# Altium schematic sheet 57. EVM SOC CURRENT_SENSE_RES.SchDoc: SOC - CURRENT SENSE RESISTORS
size 513 x 386 mm; Project: PROC154E2(001)_SK_AM69; Issue: 1.0; RevCode: E3; Page Create Date: March  8, 1995; Variant Name: Core Design; Schematic Page Number: 57; Page Number: 57; Page Size: C; Comment: MISTRAL_TITLEBLK_CSIZE_1; Page Count: 62; Schematic Page Count: 62; Name: PROC154E2 001 SK AM69; DsnPath: C:\Users\danie\Downloads\sprr466c\PROC154E3_RP\PROC154E3_SCH.DSN; SchematicName: SCHEMATIC1; PageName: 57. EVM SOC CURRENT_SENSE_RES; PageSize: C; TopSchematic: True
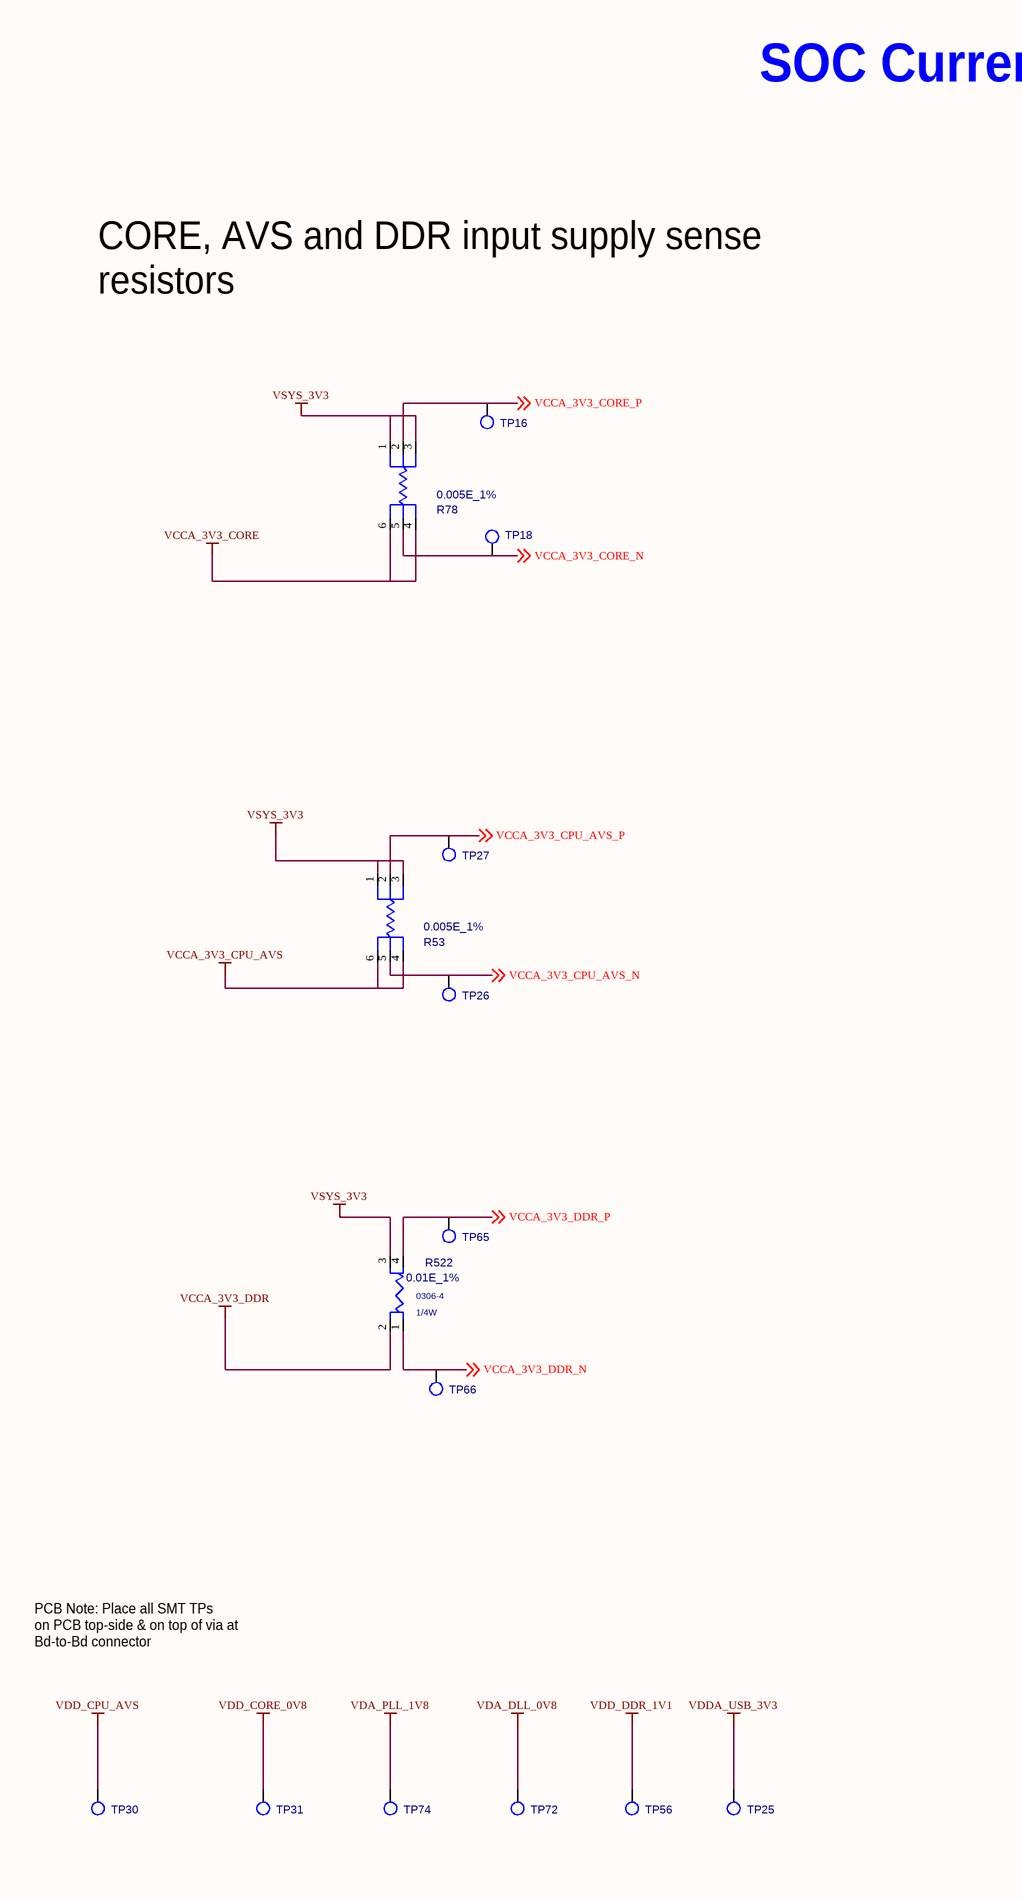
[diagram p0: 57. EVM SOC CURRENT_SENSE_RES.SchDoc, left]
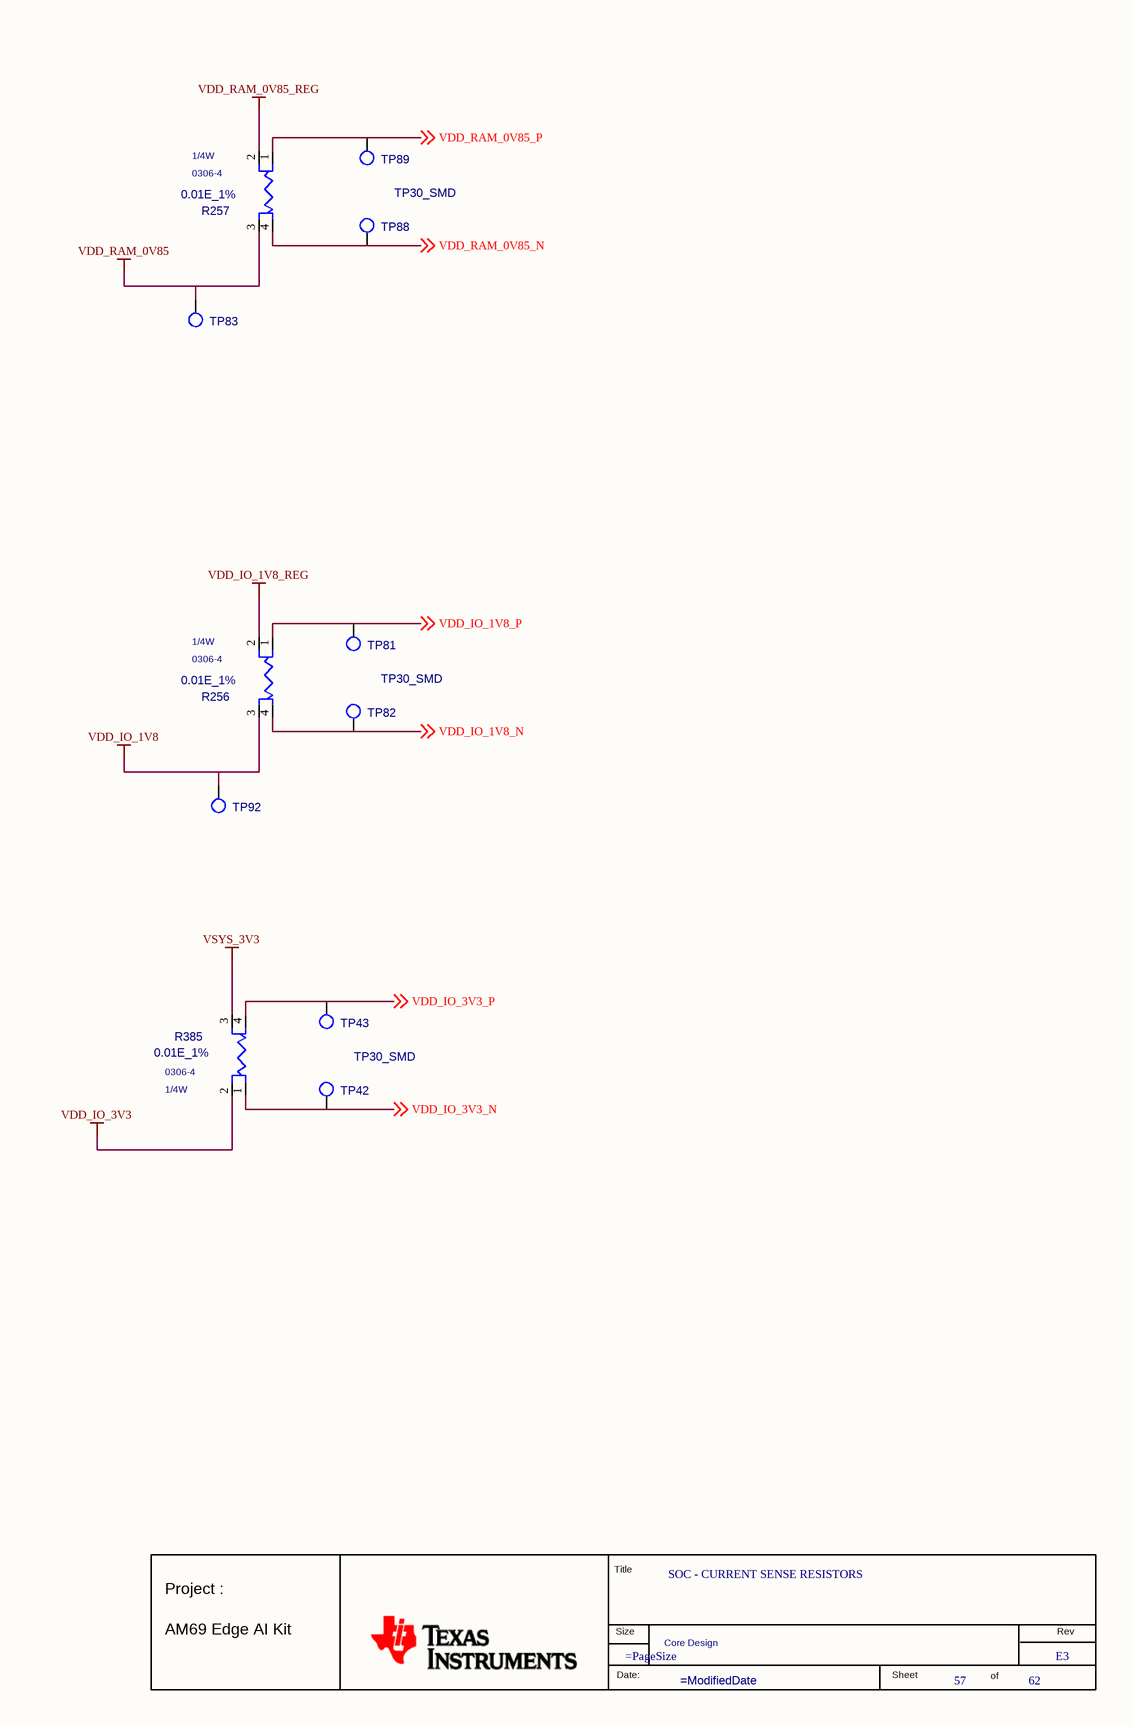
[diagram p1: 57. EVM SOC CURRENT_SENSE_RES.SchDoc, right]

## Parts
*  RevCode: E3  Title: SOC - CURRENT SENSE RESISTORS  Page Number: 57  Page Count: 62  Variant Name: Core Design  (hidden comment: MISTRAL_TITLEBLK_CSIZE_1)  (graphical)
R53  0.005E_1%  [RES_KRL3216_1206-6_0-7_TI]
R78  0.005E_1%  [RES_KRL3216_1206-6_0-7_TI]
R256  0.01E_1%  Wattage: 1/4W  Package: 0306-4  [RES_FC4L16_0306-4_0-7]
R257  0.01E_1%  Wattage: 1/4W  Package: 0306-4  [RES_FC4L16_0306-4_0-7]
R385  0.01E_1%  Wattage: 1/4W  Package: 0306-4  [RES_FC4L16_0306-4_0-7]
R522  0.01E_1%  Package: 0306-4  Wattage: 1/4W  [RES_FC4L16_0306-4_0-7]
TP16  TP30_SMD  [TP30_SMD]  (value not drawn)
TP18  TP30_SMD  [TP30_SMD]  (value not drawn)
TP25  TP30_SMD  [TP30_SMD]  (value not drawn)
TP26  TP30_SMD  [TP30_SMD]  (value not drawn)
TP27  TP30_SMD  [TP30_SMD]  (value not drawn)
TP30  TP30_SMD  [TP30_SMD]  (value not drawn)
TP31  TP30_SMD  [TP30_SMD]  (value not drawn)
TP42  TP30_SMD  [TP30_SMD]
TP43  TP30_SMD  [TP30_SMD]  (value not drawn)
TP56  TP30_SMD  [TP30_SMD]  (value not drawn)
TP65  TP30_SMD  [TP30_SMD]  (value not drawn)
TP66  TP30_SMD  [TP30_SMD]  (value not drawn)
TP72  TP30_SMD  [TP30_SMD]  (value not drawn)
TP74  TP30_SMD  [TP30_SMD]  (value not drawn)
TP81  TP30_SMD  [TP30_SMD]  (value not drawn)
TP82  TP30_SMD  [TP30_SMD]
TP83  TP30_SMD  [TP30_SMD]  (value not drawn)
TP88  TP30_SMD  [TP30_SMD]
TP89  TP30_SMD  [TP30_SMD]  (value not drawn)
TP92  TP30_SMD  [TP30_SMD]  (value not drawn)

## Nets
VCCA_3V3_CORE: R78.4 R78.6
VCCA_3V3_CPU_AVS: R53.4 R53.6
VCCA_3V3_DDR: R522.2
VDA_DLL_0V8: TP72.1(TP)
VDA_PLL_1V8: TP74.1(TP)
VDD_CORE_0V8: TP31.1(TP)
VDD_CPU_AVS: TP30.1(TP)
VDD_DDR_1V1: TP56.1(TP)
VDD_IO_1V8: R256.3 TP92.1(TP)
VDD_IO_1V8_REG: R256.2
VDD_IO_3V3: R385.2
VDD_RAM_0V85: R257.3 TP83.1(TP)
VDD_RAM_0V85_REG: R257.2
VDDA_USB_3V3: TP25.1(TP)
VSYS_3V3: R53.1 R53.3 R78.1 R78.3 R385.3 R522.3
VCCA_3V3_CORE_N: R78.5 TP18.1(TP) ; off-sheet VCCA_3V3_CORE_N
VCCA_3V3_CORE_P: R78.2 TP16.1(TP) ; off-sheet VCCA_3V3_CORE_P
VCCA_3V3_CPU_AVS_N: R53.5 TP26.1(TP) ; off-sheet VCCA_3V3_CPU_AVS_N
VCCA_3V3_CPU_AVS_P: R53.2 TP27.1(TP) ; off-sheet VCCA_3V3_CPU_AVS_P
VCCA_3V3_DDR_N: R522.1 TP66.1(TP) ; off-sheet VCCA_3V3_DDR_N
VCCA_3V3_DDR_P: R522.4 TP65.1(TP) ; off-sheet VCCA_3V3_DDR_P
VDD_IO_1V8_N: R256.4 TP82.1(TP) ; off-sheet VDD_IO_1V8_N
VDD_IO_1V8_P: R256.1 TP81.1(TP) ; off-sheet VDD_IO_1V8_P
VDD_IO_3V3_N: R385.1 TP42.1(TP) ; off-sheet VDD_IO_3V3_N
VDD_IO_3V3_P: R385.4 TP43.1(TP) ; off-sheet VDD_IO_3V3_P
VDD_RAM_0V85_N: R257.4 TP88.1(TP) ; off-sheet VDD_RAM_0V85_N
VDD_RAM_0V85_P: R257.1 TP89.1(TP) ; off-sheet VDD_RAM_0V85_P

## Notes on the sheet
- SOC Current Sense Resistors
- CORE, AVS and DDR input supply sense
  resistors
- PCB Note: Place all SMT TPs
  on PCB top-side & on top of via at
  Bd-to-Bd connector
- (in symbol MISTRAL_TITLEBLK_CSIZE_1) Title; Project :; Size; Rev; AM69 Edge AI Kit; Date:; Sheet; of

## Library data of the parts
* = MISTRAL_TITLEBLK_CSIZE_1: Issue: 1.0; Project: PROC154E2(001)_SK_AM69; Name: PROC154E2 001 SK AM69; Page Create Date: March  8, 1995; Page Size: =PageSize; Page Modify Date: =ModifiedDate; Schematic Page Count: 62; Schematic Page Number: 57
R53 = RESISTOR_KRL_TI: RES 0.005E 1.5W 1% 1206-W; Part Reference: R53; Part_type: RESISTORS\FIXED; Mfr_part_number: KRL3216E-C-R005-F-T1_TI; Mfr_name: SUSUMU; Mistral Part No: 110019080004-R; Custom_Duty: 15%; Customs_HS_Code: 85332119; Voltage: NA; Project: J7ES_SOM_DUAL-LEO_PMIC; Value: 0.005E_1%; Footprint Path: Y:\MIS_DATABASE\Library\ALTIUM_TOOL\PCB_FOOTPRINTS\Altium_Footprint_Lib.PcbLib; Library Path: Y:\MIS_DATABASE\Library\ALTIUM_TOOL\SCHEMATICS_PARTS\MS_DISCRETE_Library.schlib; MECHANICAL 3D STEP FILE: RES_KRL3216_1206-6_0-7_TI; Chkd/date: MANIRAJA/020819; Crtd /date: ALVY/010819; Datasheet: Y:\MIS_DATABASE\DATASHEETS\RESISTORS\KRL_TI-SERIES.PDF; Temperature: -55°C+175°C; Weight: NA; Height: 0.70MM; Library Ref: RESISTOR_KRL_TI; Distributor_part_number: 754-KRL3216ECR005FT1; Distributor_name: MOUSER; Package: 1206-W; Wattage: 1.5W; Tolerance: 1%; Footprint Ref: RES_KRL3216_1206-6_0-7_TI; PCB Footprint: RES_KRL3216_1206-6_0-7_TI
R78 = RESISTOR_KRL_TI: RES 0.005E 1.5W 1% 1206-W; Part Reference: R78; Mistral Part No: 110019080004-R; Mfr_name: SUSUMU; Mfr_part_number: KRL3216E-C-R005-F-T1_TI; Part_type: RESISTORS\FIXED; Project: J7ES_SOM_DUAL-LEO_PMIC; Voltage: NA; Customs_HS_Code: 85332119; Custom_Duty: 15%; Value: 0.005E_1%; Footprint Ref: RES_KRL3216_1206-6_0-7_TI; Tolerance: 1%; Wattage: 1.5W; Package: 1206-W; Distributor_name: MOUSER; Distributor_part_number: 754-KRL3216ECR005FT1; Library Ref: RESISTOR_KRL_TI; Height: 0.70MM; Weight: NA; Temperature: -55°C+175°C; Datasheet: Y:\MIS_DATABASE\DATASHEETS\RESISTORS\KRL_TI-SERIES.PDF; Crtd /date: ALVY/010819; Chkd/date: MANIRAJA/020819; MECHANICAL 3D STEP FILE: RES_KRL3216_1206-6_0-7_TI; Library Path: Y:\MIS_DATABASE\Library\ALTIUM_TOOL\SCHEMATICS_PARTS\MS_DISCRETE_Library.schlib; Footprint Path: Y:\MIS_DATABASE\Library\ALTIUM_TOOL\PCB_FOOTPRINTS\Altium_Footprint_Lib.PcbLib; PCB Footprint: RES_KRL3216_1206-6_0-7_TI
R256 = RESISTOR-4TERM: RES CURRENT SENSE 0.01E 1/4W 1% 0306-4; Part Reference: R256; Mistral Part No: 110018100017-R; Mfr_name: OHMITE; Mfr_part_number: FC4L16R010FER; Part_type: RESISTORS\FIXED; Project: TI_J7ES_EVM_SOM; Voltage: NA; Customs_HS_Code: 85332119; Custom_Duty: 15%; Value: 0.01E_1%; PCB Footprint: RES_FC4L16_0306-4_0-7; Footprint Ref: RES_FC4L16_0306-4_0-7; Tolerance: 1%; Distributor_name: DIGIKEY; Distributor_part_number: FC4L16R010FERCT-ND; Library Ref: RESISTOR-4TERM; Height: 0.70MM; Weight: 4mg; Temperature: -40°C+125°C; Datasheet: Y:\MIS_DATABASE\DATASHEETS\RESISTORS\FC4L-SERIES.PDF; Crtd /date: ALVY/261018; Chkd/date: MANIRAJA/261018; MECHANICAL 3D STEP FILE: RES_FC4L16_0306-4_0-7; Library Path: Y:\MIS_DATABASE\Library\ALTIUM_TOOL\SCHEMATICS_PARTS\MS_DISCRETE_Library.schlib; Footprint Path: Y:\MIS_DATABASE\Library\ALTIUM_TOOL\PCB_FOOTPRINTS\Altium_Footprint_Lib.PcbLib; Manufacturer: OHMITE
R257 = RESISTOR-4TERM: RES CURRENT SENSE 0.01E 1/4W 1% 0306-4; Part Reference: R257; Manufacturer: OHMITE; Mistral Part No: 110018100017-R; Mfr_part_number: FC4L16R010FER; Part_type: RESISTORS\FIXED; Project: TI_J7ES_EVM_SOM; Voltage: NA; Customs_HS_Code: 85332119; Custom_Duty: 15%; Value: 0.01E_1%; PCB Footprint: RES_FC4L16_0306-4_0-7; Footprint Ref: RES_FC4L16_0306-4_0-7; Mfr_name: OHMITE; Tolerance: 1%; Distributor_name: DIGIKEY; Distributor_part_number: FC4L16R010FERCT-ND; Library Ref: RESISTOR-4TERM; Height: 0.70MM; Weight: 4mg; Temperature: -40°C+125°C; Datasheet: Y:\MIS_DATABASE\DATASHEETS\RESISTORS\FC4L-SERIES.PDF; Crtd /date: ALVY/261018; Chkd/date: MANIRAJA/261018; MECHANICAL 3D STEP FILE: RES_FC4L16_0306-4_0-7; Library Path: Y:\MIS_DATABASE\Library\ALTIUM_TOOL\SCHEMATICS_PARTS\MS_DISCRETE_Library.schlib; Footprint Path: Y:\MIS_DATABASE\Library\ALTIUM_TOOL\PCB_FOOTPRINTS\Altium_Footprint_Lib.PcbLib
R385 = RESISTOR-4TERM: RES CURRENT SENSE 0.01E 1/4W 1% 0306-4; Part Reference: R385; Manufacturer: OHMITE; Mistral Part No: 110018100017-R; Mfr_part_number: FC4L16R010FER; Part_type: RESISTORS\FIXED; Project: TI_J7ES_EVM_SOM; Voltage: NA; Customs_HS_Code: 85332119; Custom_Duty: 15%; Value: 0.01E_1%; PCB Footprint: RES_FC4L16_0306-4_0-7; Footprint Ref: RES_FC4L16_0306-4_0-7; Mfr_name: OHMITE; Tolerance: 1%; Distributor_name: DIGIKEY; Distributor_part_number: FC4L16R010FERCT-ND; Library Ref: RESISTOR-4TERM; Height: 0.70MM; Weight: 4mg; Temperature: -40°C+125°C; Datasheet: Y:\MIS_DATABASE\DATASHEETS\RESISTORS\FC4L-SERIES.PDF; Crtd /date: ALVY/261018; Chkd/date: MANIRAJA/261018; MECHANICAL 3D STEP FILE: RES_FC4L16_0306-4_0-7; Library Path: Y:\MIS_DATABASE\Library\ALTIUM_TOOL\SCHEMATICS_PARTS\MS_DISCRETE_Library.schlib; Footprint Path: Y:\MIS_DATABASE\Library\ALTIUM_TOOL\PCB_FOOTPRINTS\Altium_Footprint_Lib.PcbLib
R522 = RESISTOR-4TERM: RES CURRENT SENSE 0.01E 1/4W 1% 0306-4; Part Reference: R522; Part_type: RESISTORS\FIXED; Mfr_part_number: FC4L16R010FER; Mfr_name: OHMITE; Mistral Part No: 110018100017-R; Custom_Duty: 15%; Customs_HS_Code: 85332119; Voltage: NA; Project: TI_J7ES_EVM_SOM; Value: 0.01E_1%; Footprint Path: Y:\MIS_DATABASE\Library\ALTIUM_TOOL\PCB_FOOTPRINTS\Altium_Footprint_Lib.PcbLib; Library Path: Y:\MIS_DATABASE\Library\ALTIUM_TOOL\SCHEMATICS_PARTS\MS_DISCRETE_Library.schlib; MECHANICAL 3D STEP FILE: RES_FC4L16_0306-4_0-7; Chkd/date: MANIRAJA/261018; Crtd /date: ALVY/261018; Datasheet: Y:\MIS_DATABASE\DATASHEETS\RESISTORS\FC4L-SERIES.PDF; Temperature: -40°C+125°C; Weight: 4mg; Height: 0.70MM; Library Ref: RESISTOR-4TERM; Distributor_part_number: FC4L16R010FERCT-ND; Distributor_name: DIGIKEY; Tolerance: 1%; Footprint Ref: RES_FC4L16_0306-4_0-7; Manufacturer: OHMITE; PCB Footprint: RES_FC4L16_0306-4_0-7
TP16 = TESTPOINT_Dup1: TESTPOINT CIR 30 SMD; Part Reference: TP16; Manufacturer: LOCAL; Mistral Part No: 130009030930; Project: BT MODULE_CSRBC04; Tolerance: NA; Value: TP30_SMD; Footprint Ref: TP30_SMD; Mfr_name: LOCAL; Mfr_part_number: TP30_SMD; Part_type: TESTPOINT; Voltage: NA; Wattage: NA; Package: SMD; Distributor_name: NA; Distributor_part_number: NA; Library Ref: TESTPOINT; Height: NA; Weight: NA; Temperature: NA; Datasheet: NA; Crtd /date: MAZHAR/171006; Chkd/date: SHREESHAIL/171006; RoHS: NA; Customs_HS_Code: NA; Custom_Duty: NA; MECHANICAL 3D STEP FILE: NA; Library Path: Y:\MIS_DATABASE\Library\ALTIUM_TOOL\SCHEMATICS_PARTS\MS_DISCRETE_Library.schlib; Footprint Path: Y:\MIS_DATABASE\Library\ALTIUM_TOOL\PCB_FOOTPRINTS\Altium_Footprint_Lib.PcbLib; PCB Footprint: TP30_SMD
TP18 = TESTPOINT_Dup1: TESTPOINT CIR 30 SMD; Part Reference: TP18; Manufacturer: LOCAL; Mistral Part No: 130009030930; Project: BT MODULE_CSRBC04; Tolerance: NA; Value: TP30_SMD; Footprint Ref: TP30_SMD; Mfr_name: LOCAL; Mfr_part_number: TP30_SMD; Part_type: TESTPOINT; Voltage: NA; Wattage: NA; Package: SMD; Distributor_name: NA; Distributor_part_number: NA; Library Ref: TESTPOINT; Height: NA; Weight: NA; Temperature: NA; Datasheet: NA; Crtd /date: MAZHAR/171006; Chkd/date: SHREESHAIL/171006; RoHS: NA; Customs_HS_Code: NA; Custom_Duty: NA; MECHANICAL 3D STEP FILE: NA; Library Path: Y:\MIS_DATABASE\Library\ALTIUM_TOOL\SCHEMATICS_PARTS\MS_DISCRETE_Library.schlib; Footprint Path: Y:\MIS_DATABASE\Library\ALTIUM_TOOL\PCB_FOOTPRINTS\Altium_Footprint_Lib.PcbLib; PCB Footprint: TP30_SMD
TP25 = TESTPOINT_Dup1: TESTPOINT CIR 30 SMD; Part Reference: TP25; Manufacturer: LOCAL; Mistral Part No: 130009030930; MECHANICAL 3D STEP FILE: NA; Project: BT MODULE_CSRBC04; Value: TP30_SMD; PCB Footprint: TP30_SMD; Footprint Path: Y:\MIS_DATABASE\Library\ALTIUM_TOOL\PCB_FOOTPRINTS\Altium_Footprint_Lib.PcbLib; Library Path: Y:\MIS_DATABASE\Library\ALTIUM_TOOL\SCHEMATICS_PARTS\MS_DISCRETE_Library.schlib; Custom_Duty: NA; Customs_HS_Code: NA; RoHS: NA; Chkd/date: SHREESHAIL/171006; Crtd /date: MAZHAR/171006; Datasheet: NA; Temperature: NA; Weight: NA; Height: NA; Library Ref: TESTPOINT; Distributor_part_number: NA; Distributor_name: NA; Package: SMD; Wattage: NA; Voltage: NA; Tolerance: NA; Part_type: TESTPOINT; Mfr_part_number: TP30_SMD; Mfr_name: LOCAL; Footprint Ref: TP30_SMD
TP26 = TESTPOINT_Dup1: TESTPOINT CIR 30 SMD; Part Reference: TP26; Mfr_name: LOCAL; Mistral Part No: 130009030930; MECHANICAL 3D STEP FILE: NA; Project: BT MODULE_CSRBC04; Value: TP30_SMD; Footprint Path: Y:\MIS_DATABASE\Library\ALTIUM_TOOL\PCB_FOOTPRINTS\Altium_Footprint_Lib.PcbLib; Library Path: Y:\MIS_DATABASE\Library\ALTIUM_TOOL\SCHEMATICS_PARTS\MS_DISCRETE_Library.schlib; Custom_Duty: NA; Customs_HS_Code: NA; RoHS: NA; Chkd/date: SHREESHAIL/171006; Crtd /date: MAZHAR/171006; Datasheet: NA; Temperature: NA; Weight: NA; Height: NA; Library Ref: TESTPOINT; Distributor_part_number: NA; Distributor_name: NA; Package: SMD; Wattage: NA; Voltage: NA; Tolerance: NA; Part_type: TESTPOINT; Mfr_part_number: TP30_SMD; Footprint Ref: TP30_SMD; Manufacturer: LOCAL; PCB Footprint: TP30_SMD
TP27 = TESTPOINT_Dup1: TESTPOINT CIR 30 SMD; Part Reference: TP27; Mfr_name: LOCAL; Mistral Part No: 130009030930; MECHANICAL 3D STEP FILE: NA; Project: BT MODULE_CSRBC04; Value: TP30_SMD; Footprint Path: Y:\MIS_DATABASE\Library\ALTIUM_TOOL\PCB_FOOTPRINTS\Altium_Footprint_Lib.PcbLib; Library Path: Y:\MIS_DATABASE\Library\ALTIUM_TOOL\SCHEMATICS_PARTS\MS_DISCRETE_Library.schlib; Custom_Duty: NA; Customs_HS_Code: NA; RoHS: NA; Chkd/date: SHREESHAIL/171006; Crtd /date: MAZHAR/171006; Datasheet: NA; Temperature: NA; Weight: NA; Height: NA; Library Ref: TESTPOINT; Distributor_part_number: NA; Distributor_name: NA; Package: SMD; Wattage: NA; Voltage: NA; Tolerance: NA; Part_type: TESTPOINT; Mfr_part_number: TP30_SMD; Footprint Ref: TP30_SMD; Manufacturer: LOCAL; PCB Footprint: TP30_SMD
TP30 = TESTPOINT_Dup1: TESTPOINT CIR 30 SMD; Part Reference: TP30; Mistral Part No: 130009030930; Mfr_name: LOCAL; Project: BT MODULE_CSRBC04; Tolerance: NA; Value: TP30_SMD; Footprint Ref: TP30_SMD; Mfr_part_number: TP30_SMD; Part_type: TESTPOINT; Voltage: NA; Wattage: NA; Package: SMD; Distributor_name: NA; Distributor_part_number: NA; Library Ref: TESTPOINT; Height: NA; Weight: NA; Temperature: NA; Datasheet: NA; Crtd /date: MAZHAR/171006; Chkd/date: SHREESHAIL/171006; RoHS: NA; Customs_HS_Code: NA; Custom_Duty: NA; MECHANICAL 3D STEP FILE: NA; Library Path: Y:\MIS_DATABASE\Library\ALTIUM_TOOL\SCHEMATICS_PARTS\MS_DISCRETE_Library.schlib; Footprint Path: Y:\MIS_DATABASE\Library\ALTIUM_TOOL\PCB_FOOTPRINTS\Altium_Footprint_Lib.PcbLib; Manufacturer: LOCAL; PCB Footprint: TP30_SMD
TP31 = TESTPOINT_Dup1: TESTPOINT CIR 30 SMD; Part Reference: TP31; Manufacturer: LOCAL; Mistral Part No: 130009030930; MECHANICAL 3D STEP FILE: NA; Project: BT MODULE_CSRBC04; Value: TP30_SMD; Footprint Path: Y:\MIS_DATABASE\Library\ALTIUM_TOOL\PCB_FOOTPRINTS\Altium_Footprint_Lib.PcbLib; Library Path: Y:\MIS_DATABASE\Library\ALTIUM_TOOL\SCHEMATICS_PARTS\MS_DISCRETE_Library.schlib; Custom_Duty: NA; Customs_HS_Code: NA; RoHS: NA; Chkd/date: SHREESHAIL/171006; Crtd /date: MAZHAR/171006; Datasheet: NA; Temperature: NA; Weight: NA; Height: NA; Library Ref: TESTPOINT; Distributor_part_number: NA; Distributor_name: NA; Package: SMD; Wattage: NA; Voltage: NA; Tolerance: NA; Part_type: TESTPOINT; Mfr_part_number: TP30_SMD; Mfr_name: LOCAL; Footprint Ref: TP30_SMD; PCB Footprint: TP30_SMD
TP42 = TESTPOINT_Dup1: TESTPOINT CIR 30 SMD; Part Reference: TP42; Manufacturer: LOCAL; Mistral Part No: 130009030930; MECHANICAL 3D STEP FILE: NA; Project: BT MODULE_CSRBC04; Value: TP30_SMD; PCB Footprint: TP30_SMD; Footprint Path: Y:\MIS_DATABASE\Library\ALTIUM_TOOL\PCB_FOOTPRINTS\Altium_Footprint_Lib.PcbLib; Library Path: Y:\MIS_DATABASE\Library\ALTIUM_TOOL\SCHEMATICS_PARTS\MS_DISCRETE_Library.schlib; Custom_Duty: NA; Customs_HS_Code: NA; RoHS: NA; Chkd/date: SHREESHAIL/171006; Crtd /date: MAZHAR/171006; Datasheet: NA; Temperature: NA; Weight: NA; Height: NA; Library Ref: TESTPOINT; Distributor_part_number: NA; Distributor_name: NA; Package: SMD; Wattage: NA; Voltage: NA; Tolerance: NA; Part_type: TESTPOINT; Mfr_part_number: TP30_SMD; Mfr_name: LOCAL; Footprint Ref: TP30_SMD
TP43 = TESTPOINT_Dup1: TESTPOINT CIR 30 SMD; Part Reference: TP43; Manufacturer: LOCAL; Mistral Part No: 130009030930; MECHANICAL 3D STEP FILE: NA; Project: BT MODULE_CSRBC04; Value: TP30_SMD; PCB Footprint: TP30_SMD; Footprint Path: Y:\MIS_DATABASE\Library\ALTIUM_TOOL\PCB_FOOTPRINTS\Altium_Footprint_Lib.PcbLib; Library Path: Y:\MIS_DATABASE\Library\ALTIUM_TOOL\SCHEMATICS_PARTS\MS_DISCRETE_Library.schlib; Custom_Duty: NA; Customs_HS_Code: NA; RoHS: NA; Chkd/date: SHREESHAIL/171006; Crtd /date: MAZHAR/171006; Datasheet: NA; Temperature: NA; Weight: NA; Height: NA; Library Ref: TESTPOINT; Distributor_part_number: NA; Distributor_name: NA; Package: SMD; Wattage: NA; Voltage: NA; Tolerance: NA; Part_type: TESTPOINT; Mfr_part_number: TP30_SMD; Mfr_name: LOCAL; Footprint Ref: TP30_SMD
TP56 = TESTPOINT_Dup1: TESTPOINT CIR 30 SMD; Part Reference: TP56; Manufacturer: LOCAL; Mistral Part No: 130009030930; MECHANICAL 3D STEP FILE: NA; Project: BT MODULE_CSRBC04; Value: TP30_SMD; PCB Footprint: TP30_SMD; Footprint Path: Y:\MIS_DATABASE\Library\ALTIUM_TOOL\PCB_FOOTPRINTS\Altium_Footprint_Lib.PcbLib; Library Path: Y:\MIS_DATABASE\Library\ALTIUM_TOOL\SCHEMATICS_PARTS\MS_DISCRETE_Library.schlib; Custom_Duty: NA; Customs_HS_Code: NA; RoHS: NA; Chkd/date: SHREESHAIL/171006; Crtd /date: MAZHAR/171006; Datasheet: NA; Temperature: NA; Weight: NA; Height: NA; Library Ref: TESTPOINT; Distributor_part_number: NA; Distributor_name: NA; Package: SMD; Wattage: NA; Voltage: NA; Tolerance: NA; Part_type: TESTPOINT; Mfr_part_number: TP30_SMD; Mfr_name: LOCAL; Footprint Ref: TP30_SMD
TP65 = TESTPOINT_Dup1: TESTPOINT CIR 30 SMD; Part Reference: TP65; Manufacturer: LOCAL; Mistral Part No: 130009030930; Project: BT MODULE_CSRBC04; Tolerance: NA; Value: TP30_SMD; Footprint Ref: TP30_SMD; Mfr_name: LOCAL; Mfr_part_number: TP30_SMD; Part_type: TESTPOINT; Voltage: NA; Wattage: NA; Package: SMD; Distributor_name: NA; Distributor_part_number: NA; Library Ref: TESTPOINT; Height: NA; Weight: NA; Temperature: NA; Datasheet: NA; Crtd /date: MAZHAR/171006; Chkd/date: SHREESHAIL/171006; RoHS: NA; Customs_HS_Code: NA; Custom_Duty: NA; MECHANICAL 3D STEP FILE: NA; Library Path: Y:\MIS_DATABASE\Library\ALTIUM_TOOL\SCHEMATICS_PARTS\MS_DISCRETE_Library.schlib; Footprint Path: Y:\MIS_DATABASE\Library\ALTIUM_TOOL\PCB_FOOTPRINTS\Altium_Footprint_Lib.PcbLib; PCB Footprint: TP30_SMD
TP66 = TESTPOINT_Dup1: TESTPOINT CIR 30 SMD; Part Reference: TP66; Manufacturer: LOCAL; Mistral Part No: 130009030930; Project: BT MODULE_CSRBC04; Tolerance: NA; Value: TP30_SMD; Footprint Ref: TP30_SMD; Mfr_name: LOCAL; Mfr_part_number: TP30_SMD; Part_type: TESTPOINT; Voltage: NA; Wattage: NA; Package: SMD; Distributor_name: NA; Distributor_part_number: NA; Library Ref: TESTPOINT; Height: NA; Weight: NA; Temperature: NA; Datasheet: NA; Crtd /date: MAZHAR/171006; Chkd/date: SHREESHAIL/171006; RoHS: NA; Customs_HS_Code: NA; Custom_Duty: NA; MECHANICAL 3D STEP FILE: NA; Library Path: Y:\MIS_DATABASE\Library\ALTIUM_TOOL\SCHEMATICS_PARTS\MS_DISCRETE_Library.schlib; Footprint Path: Y:\MIS_DATABASE\Library\ALTIUM_TOOL\PCB_FOOTPRINTS\Altium_Footprint_Lib.PcbLib; PCB Footprint: TP30_SMD
TP72 = TESTPOINT_Dup1: TESTPOINT CIR 30 SMD; Part Reference: TP72; Manufacturer: LOCAL; Mistral Part No: 130009030930; MECHANICAL 3D STEP FILE: NA; Project: BT MODULE_CSRBC04; Value: TP30_SMD; Footprint Path: Y:\MIS_DATABASE\Library\ALTIUM_TOOL\PCB_FOOTPRINTS\Altium_Footprint_Lib.PcbLib; Library Path: Y:\MIS_DATABASE\Library\ALTIUM_TOOL\SCHEMATICS_PARTS\MS_DISCRETE_Library.schlib; Custom_Duty: NA; Customs_HS_Code: NA; RoHS: NA; Chkd/date: SHREESHAIL/171006; Crtd /date: MAZHAR/171006; Datasheet: NA; Temperature: NA; Weight: NA; Height: NA; Library Ref: TESTPOINT; Distributor_part_number: NA; Distributor_name: NA; Package: SMD; Wattage: NA; Voltage: NA; Tolerance: NA; Part_type: TESTPOINT; Mfr_part_number: TP30_SMD; Mfr_name: LOCAL; Footprint Ref: TP30_SMD; PCB Footprint: TP30_SMD
TP74 = TESTPOINT_Dup1: TESTPOINT CIR 30 SMD; Part Reference: TP74; Manufacturer: LOCAL; Mistral Part No: 130009030930; MECHANICAL 3D STEP FILE: NA; Project: BT MODULE_CSRBC04; Value: TP30_SMD; Footprint Path: Y:\MIS_DATABASE\Library\ALTIUM_TOOL\PCB_FOOTPRINTS\Altium_Footprint_Lib.PcbLib; Library Path: Y:\MIS_DATABASE\Library\ALTIUM_TOOL\SCHEMATICS_PARTS\MS_DISCRETE_Library.schlib; Custom_Duty: NA; Customs_HS_Code: NA; RoHS: NA; Chkd/date: SHREESHAIL/171006; Crtd /date: MAZHAR/171006; Datasheet: NA; Temperature: NA; Weight: NA; Height: NA; Library Ref: TESTPOINT; Distributor_part_number: NA; Distributor_name: NA; Package: SMD; Wattage: NA; Voltage: NA; Tolerance: NA; Part_type: TESTPOINT; Mfr_part_number: TP30_SMD; Mfr_name: LOCAL; Footprint Ref: TP30_SMD; PCB Footprint: TP30_SMD
TP81 = TESTPOINT_Dup1: TESTPOINT CIR 30 SMD; Part Reference: TP81; Mistral Part No: 130009030930; Mfr_name: LOCAL; Project: BT MODULE_CSRBC04; Tolerance: NA; Value: TP30_SMD; PCB Footprint: TP30_SMD; Footprint Ref: TP30_SMD; Mfr_part_number: TP30_SMD; Part_type: TESTPOINT; Voltage: NA; Wattage: NA; Package: SMD; Distributor_name: NA; Distributor_part_number: NA; Library Ref: TESTPOINT; Height: NA; Weight: NA; Temperature: NA; Datasheet: NA; Crtd /date: MAZHAR/171006; Chkd/date: SHREESHAIL/171006; RoHS: NA; Customs_HS_Code: NA; Custom_Duty: NA; MECHANICAL 3D STEP FILE: NA; Library Path: Y:\MIS_DATABASE\Library\ALTIUM_TOOL\SCHEMATICS_PARTS\MS_DISCRETE_Library.schlib; Footprint Path: Y:\MIS_DATABASE\Library\ALTIUM_TOOL\PCB_FOOTPRINTS\Altium_Footprint_Lib.PcbLib; Manufacturer: LOCAL
TP82 = TESTPOINT_Dup1: TESTPOINT CIR 30 SMD; Part Reference: TP82; Mistral Part No: 130009030930; Mfr_name: LOCAL; Project: BT MODULE_CSRBC04; Tolerance: NA; Value: TP30_SMD; PCB Footprint: TP30_SMD; Footprint Ref: TP30_SMD; Mfr_part_number: TP30_SMD; Part_type: TESTPOINT; Voltage: NA; Wattage: NA; Package: SMD; Distributor_name: NA; Distributor_part_number: NA; Library Ref: TESTPOINT; Height: NA; Weight: NA; Temperature: NA; Datasheet: NA; Crtd /date: MAZHAR/171006; Chkd/date: SHREESHAIL/171006; RoHS: NA; Customs_HS_Code: NA; Custom_Duty: NA; MECHANICAL 3D STEP FILE: NA; Library Path: Y:\MIS_DATABASE\Library\ALTIUM_TOOL\SCHEMATICS_PARTS\MS_DISCRETE_Library.schlib; Footprint Path: Y:\MIS_DATABASE\Library\ALTIUM_TOOL\PCB_FOOTPRINTS\Altium_Footprint_Lib.PcbLib; Manufacturer: LOCAL
TP83 = TESTPOINT_Dup1: TESTPOINT CIR 30 SMD; Part Reference: TP83; Manufacturer: LOCAL; Mistral Part No: 130009030930; MECHANICAL 3D STEP FILE: NA; Project: BT MODULE_CSRBC04; Value: TP30_SMD; PCB Footprint: TP30_SMD; Footprint Path: Y:\MIS_DATABASE\Library\ALTIUM_TOOL\PCB_FOOTPRINTS\Altium_Footprint_Lib.PcbLib; Library Path: Y:\MIS_DATABASE\Library\ALTIUM_TOOL\SCHEMATICS_PARTS\MS_DISCRETE_Library.schlib; Custom_Duty: NA; Customs_HS_Code: NA; RoHS: NA; Chkd/date: SHREESHAIL/171006; Crtd /date: MAZHAR/171006; Datasheet: NA; Temperature: NA; Weight: NA; Height: NA; Library Ref: TESTPOINT; Distributor_part_number: NA; Distributor_name: NA; Package: SMD; Wattage: NA; Voltage: NA; Tolerance: NA; Part_type: TESTPOINT; Mfr_part_number: TP30_SMD; Mfr_name: LOCAL; Footprint Ref: TP30_SMD
TP88 = TESTPOINT_Dup1: TESTPOINT CIR 30 SMD; Part Reference: TP88; Manufacturer: LOCAL; Mistral Part No: 130009030930; Project: BT MODULE_CSRBC04; Tolerance: NA; Value: TP30_SMD; PCB Footprint: TP30_SMD; Footprint Ref: TP30_SMD; Mfr_name: LOCAL; Mfr_part_number: TP30_SMD; Part_type: TESTPOINT; Voltage: NA; Wattage: NA; Package: SMD; Distributor_name: NA; Distributor_part_number: NA; Library Ref: TESTPOINT; Height: NA; Weight: NA; Temperature: NA; Datasheet: NA; Crtd /date: MAZHAR/171006; Chkd/date: SHREESHAIL/171006; RoHS: NA; Customs_HS_Code: NA; Custom_Duty: NA; MECHANICAL 3D STEP FILE: NA; Library Path: Y:\MIS_DATABASE\Library\ALTIUM_TOOL\SCHEMATICS_PARTS\MS_DISCRETE_Library.schlib; Footprint Path: Y:\MIS_DATABASE\Library\ALTIUM_TOOL\PCB_FOOTPRINTS\Altium_Footprint_Lib.PcbLib
TP89 = TESTPOINT_Dup1: TESTPOINT CIR 30 SMD; Part Reference: TP89; Manufacturer: LOCAL; Mistral Part No: 130009030930; Project: BT MODULE_CSRBC04; Tolerance: NA; Value: TP30_SMD; PCB Footprint: TP30_SMD; Footprint Ref: TP30_SMD; Mfr_name: LOCAL; Mfr_part_number: TP30_SMD; Part_type: TESTPOINT; Voltage: NA; Wattage: NA; Package: SMD; Distributor_name: NA; Distributor_part_number: NA; Library Ref: TESTPOINT; Height: NA; Weight: NA; Temperature: NA; Datasheet: NA; Crtd /date: MAZHAR/171006; Chkd/date: SHREESHAIL/171006; RoHS: NA; Customs_HS_Code: NA; Custom_Duty: NA; MECHANICAL 3D STEP FILE: NA; Library Path: Y:\MIS_DATABASE\Library\ALTIUM_TOOL\SCHEMATICS_PARTS\MS_DISCRETE_Library.schlib; Footprint Path: Y:\MIS_DATABASE\Library\ALTIUM_TOOL\PCB_FOOTPRINTS\Altium_Footprint_Lib.PcbLib
TP92 = TESTPOINT_Dup1: TESTPOINT CIR 30 SMD; Part Reference: TP92; Mistral Part No: 130009030930; Mfr_name: LOCAL; Project: BT MODULE_CSRBC04; Tolerance: NA; Value: TP30_SMD; PCB Footprint: TP30_SMD; Footprint Ref: TP30_SMD; Mfr_part_number: TP30_SMD; Part_type: TESTPOINT; Voltage: NA; Wattage: NA; Package: SMD; Distributor_name: NA; Distributor_part_number: NA; Library Ref: TESTPOINT; Height: NA; Weight: NA; Temperature: NA; Datasheet: NA; Crtd /date: MAZHAR/171006; Chkd/date: SHREESHAIL/171006; RoHS: NA; Customs_HS_Code: NA; Custom_Duty: NA; MECHANICAL 3D STEP FILE: NA; Library Path: Y:\MIS_DATABASE\Library\ALTIUM_TOOL\SCHEMATICS_PARTS\MS_DISCRETE_Library.schlib; Footprint Path: Y:\MIS_DATABASE\Library\ALTIUM_TOOL\PCB_FOOTPRINTS\Altium_Footprint_Lib.PcbLib; Manufacturer: LOCAL